# EAGLE schematic Final (EAGLE 9.6.2)
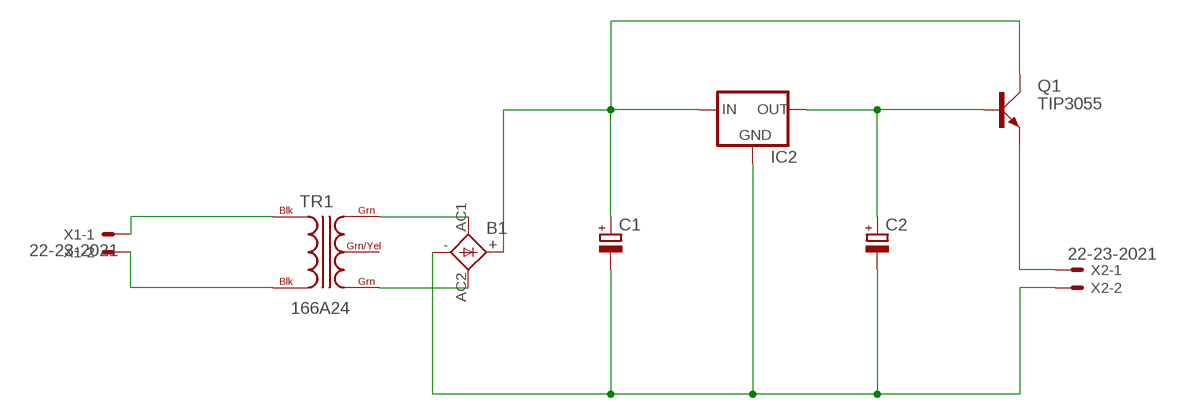
[diagram p0: schematic, sheet 1]

## Parts
B1  FB32  [FB32]
C1  CPOL-EUE7.5-16  [E7,5-16]
C2  CPOL-EUE3.5-8  [E3,5-8]
IC2  78XXL  [78XXL]
Q1  TIP3055  [TOP3AV]
TR1  166A24  [C2H]
X1  22-23-2021  [22-23-2021]
X2  22-23-2021  [22-23-2021]

## Nets
N$1: TR1.BLK@1(BLK) X1.1
N$2: TR1.BLK@2(BLK) X1.2
N$3: B1.AC1 TR1.GRN@1(GRN)
N$4: B1.AC2 TR1.GRN@2(GRN)
N$5: B1.+ C1.+ IC2.IN Q1.C
N$6: B1.- C1.- C2.- IC2.GND X2.2
N$7: Q1.E X2.1
N$8: C2.+ IC2.OUT Q1.B
Unconnected: TR1.GRN/YEL

## Library data of the parts
B1 = rectifier:FB32: FAGOR RECTIFIER grid 1 x 10,2 x 7,5 mm
C1 C2 = rcl:CPOL-EU: POLARIZED CAPACITOR, European symbol; SPICEPREFIX: C
IC2 = v-reg:78XXL: VOLTAGE REGULATOR
Q1 = transistor-power:TIP3055: NPN TRANSISTOR
TR1 = trafo-hammondmfg:166: OPEN STYLE FILAMENT & L.V. RECTIFIER USE TRANSFORMERS Economical single primnary 115VAC, 60 Hz or 117 VAC 50/60 Hz Source: Data sheet <http://www.hammondmfg.com/166.htm>
X1 X2 = con-molex:22-23-2021: .100" (2.54mm) Center Header - 2 Pin; MF: MOLEX; MPN: 22-23-2021; OC_FARNELL: 1462926; OC_NEWARK: 25C3832